# Altium project NANORACK_PHOTODIODE.PrjPcb
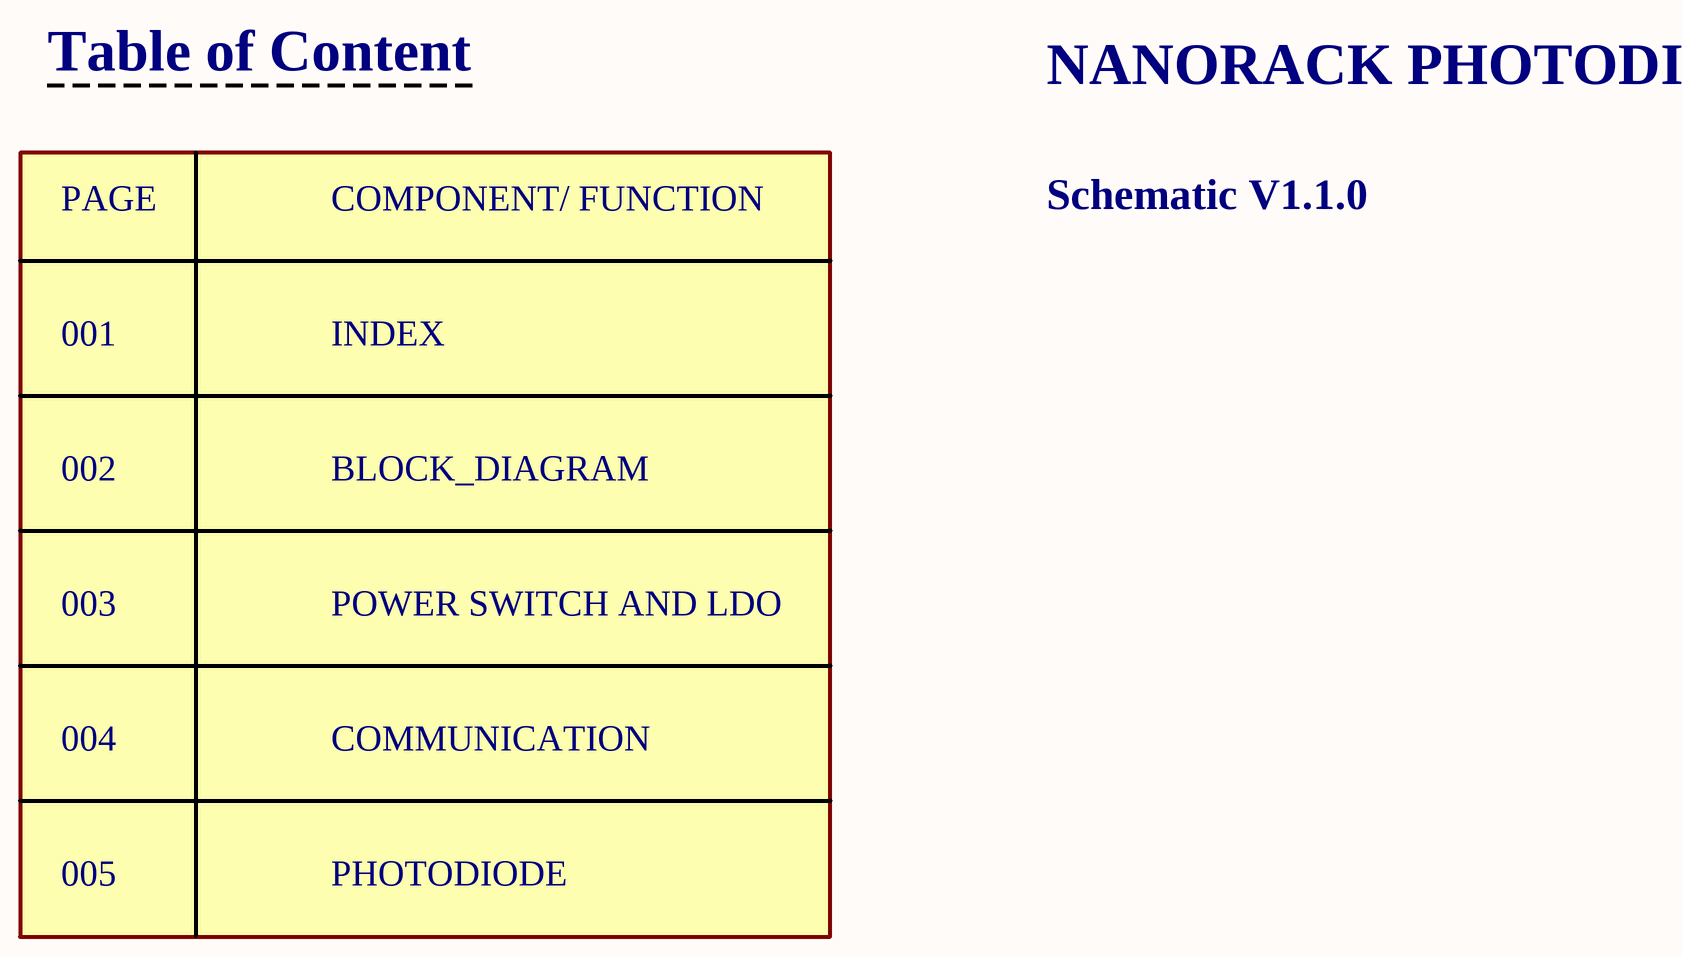
[diagram p0: INDEX.SchDoc]
5 sheets, 142 parts. Net scope: global (net labels, ports and power ports of the same name join across sheets).
Board file: PHOTODIODE_V1.2.0.PcbDoc
Sheets:
  INDEX.SchDoc
  BLOCK_DIAGRAM.SchDoc
  POWER SWITCH AND LDO.SchDoc
  COMMUNICATION.SchDoc
  PHOTODIODE.SchDoc

## Sheet INDEX.SchDoc
size 420 x 297 mm; SheetNumber: 1; SheetTotal: 5

### Notes on the sheet
- Table of Content
- NANORACK PHOTODIODE
- PAGE
- COMPONENT/ FUNCTION
- Schematic V1.1.0
- 001
- INDEX
- 002
- BLOCK_DIAGRAM
- 003
- POWER SWITCH AND LDO
- 004
- COMMUNICATION
- 005
- PHOTODIODE
- Project:
- BEE-PC1
- Sub-system:
- Design by:
- Hung Nguyen D.
- Bao Bui Q.
- Sheet title:
- Sheet
- A3
- of
- Checked by:
- Approved by:
- Vu Pham
- Revision:
- Document No:
- V1.1.0
- Size:
- Date:

## Sheet BLOCK_DIAGRAM.SchDoc
size 420 x 297 mm; SheetNumber: 2; SheetTotal: 5

### Notes on the sheet
- Project:
- BEE-PC1
- Sub-system:
- Design by:
- Hung Nguyen D.
- Bao Bui Q.
- Sheet title:
- Sheet
- A3
- of
- Checked by:
- Approved by:
- Vu Pham
- Revision:
- Document No:
- V1.1.0
- Size:
- Date:

## Sheet POWER SWITCH AND LDO.SchDoc
size 420 x 297 mm; SheetNumber: 3; SheetTotal: 5
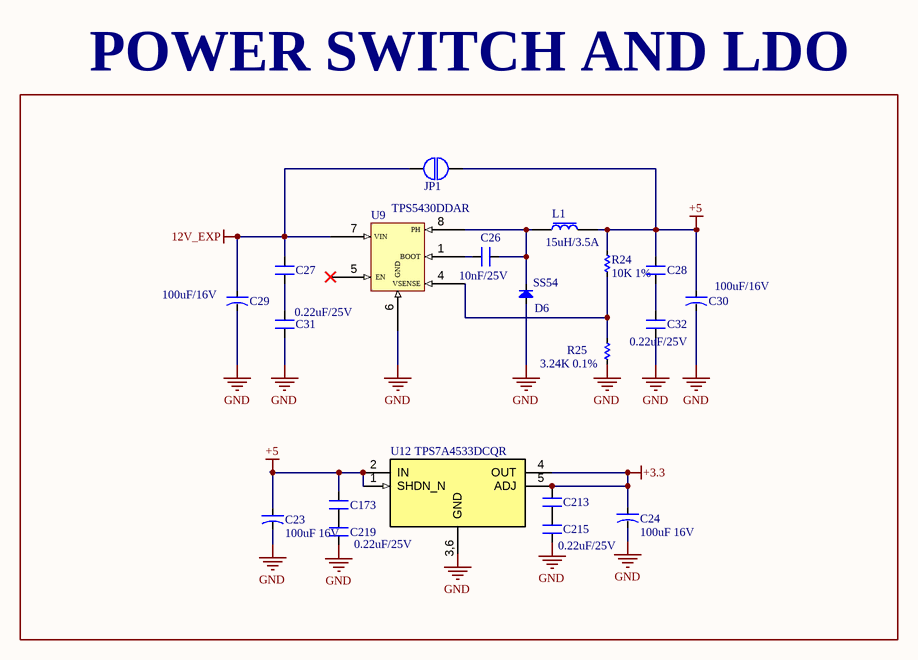
[diagram p1: POWER SWITCH AND LDO.SchDoc]

### Parts
C23  100uF 16V  [CAP TANT 2312]
C24  100uF 16V  [CAP TANT 2312]
C26  10nF/25V  [CN-SMD-0603]
C27  0.22uF/25V  [CN-SMD-0603]  (value not drawn)
C28  0.22uF/25V  [CN-SMD-0603]  (value not drawn)
C29  100uF/16V  [CAP TANT 2312]
C30  100uF/16V  [CAP TANT 2312]
C31  0.22uF/25V  [CN-SMD-0603]
C32  0.22uF/25V  [CN-SMD-0603]
C173  0.22uF/25V  [CN-SMD-0603]
C213  0.22uF/25V  [CN-SMD-0603]  (value not drawn)
C215  0.22uF/25V  [CN-SMD-0603]
C219  0.22uF/25V  [CN-SMD-0603]  (value not drawn)
D6  SS54  [DIO-SMD-A]
JP1  JUMP2  [Jump2]  (value not drawn)
L1  15uH/3.5A  [SRP7050TA]
R24  10K 1%  [RES-SMD-0603]
R25  3.24K 0.1%  [RES-SMD-0603]
U9  TPS5430DDAR  [HSOP8]
U12  TPS7A4533DCQR  [SOT223-6]

### Blocks framed on the sheet
POWER SWITCH AND LDO: C23 C24 C26-C32 C173 C213 C215 C219 D6 JP1 L1 R24 R25 U9 U12

### Nets
12V_EXP: C27.2 C29.1 JP1.1 U9.7(VIN)
+3.3: C24.1 C213.2 U12.4(OUT) U12.5(ADJ)
+5: C23.1 C28.2 C30.1 C173.2 JP1.2 L1.2 R24.2 U12.1(SHDN_N) U12.2(IN)
GND: C23.2 C24.2 C29.2 C30.2 C31.1 C32.1 C215.1 C219.1 D6.1(A) R25.1 U9.6(GND) U12.3,6(GND)
NetC26_1: C26.1 D6.2(K) L1.1 U9.8(PH)
NetC26_2: C26.2 U9.1(BOOT)
NetC27_1: C27.1 C31.2
NetC28_1: C28.1 C32.2
NetC173_1: C173.1 C219.2
NetC213_1: C213.1 C215.2
NetR24_1: R24.1 R25.2 U9.4(VSENSE)

Not connected (* = marked no-connect by the designer): U9 5(EN)*

### Notes on the sheet
- Project:
- BEE-PC1
- Sub-system:
- Design by:
- Hung Nguyen D.
- Bao Bui Q.
- Sheet title:
- Sheet
- A3
- of
- Checked by:
- Approved by:
- Vu Pham
- Revision:
- Document No:
- V1.1.0
- Size:
- Date:

### Library data of the parts
C23 C24 C29 C30 = CN-ALU-SMD: Polarized Capacitor (Axial); Published: 8-Jun-2000; LatestRevisionDate: 17-Jul-2002; LatestRevisionNote: Re-released for DXP Platform.; PackageReference: POLAR0.8; Publisher: Altium Limited
C26-C28 C31 C32 C173 C213 C215 C219 = CM: 0603; Value: 103
D6 = Diode SMD: DIODE SCHOTTKY 40V 5A SMA; Code - JEDEC: DO-214-AB; Value: 1N5007; Published: 8-Jun-2000; Revision: July-2002: Re-released for DXP Platform.; Publisher: Altium Limited
L1 = INDUCTOR: SRP7050TA-150M
R24 = Res-SMD: 0603; Manufacturer: Generic Components; Class: Passive; Published: 08/06/2000; Publisher: Altium Hobart Technology Centre
R25 = Res-SMD: ERA-3AEB3241V; Manufacturer: Generic Components; Class: Passive; Published: 08/06/2000; Publisher: Altium Hobart Technology Centre
U9 = TPS543X: 8SOP; pin to pad: 6>6+9
U12 = TPS7A4533DCQR: IC REG LINEAR 3.3V 1.5A SOT223-6

## Sheet COMMUNICATION.SchDoc
size 420 x 297 mm; SheetNumber: 4; SheetTotal: 5
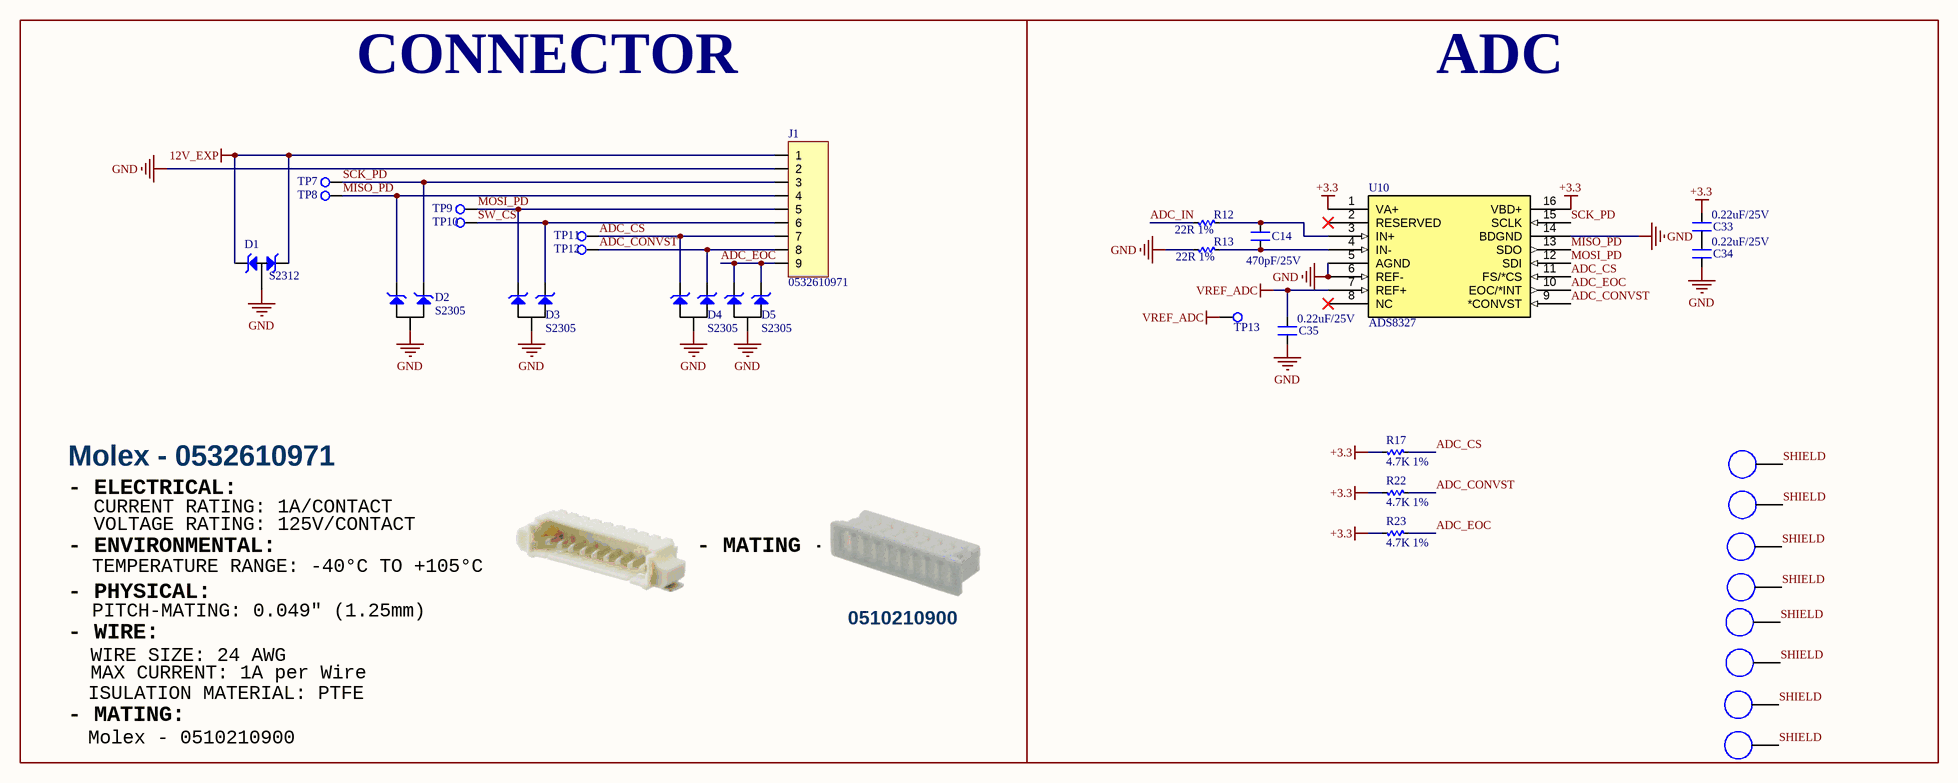
[diagram p2: COMMUNICATION.SchDoc]

### Parts
C14  470pF/25V  [CN-SMD-0603]
C33  0.22uF/25V  [CN-SMD-0603]
C34  0.22uF/25V  [CN-SMD-0603]
C35  0.22uF/25V  [CN-SMD-0603]
D1  S2312  [SOT23-123]
D2  S2305  [SOT23-123]
D3  S2305  [SOT23-123]
D4  S2305  [SOT23-123]
D5  S2305  [SOT23-123]
H1  HOLD  [M3 - 6mm]  (value not drawn)
H2  HOLD  [M3 - 6mm]  (value not drawn)
H3  HOLD  [M3 - 6mm]  (value not drawn)
H4  HOLD  [M3 - 6mm]  (value not drawn)
H5  HOLD  [M3 - 6mm]  (value not drawn)
H6  HOLD  [M3 - 6mm]  (value not drawn)
H7  HOLD  [M3 - 6mm]  (value not drawn)
H8  HOLD  [M3 - 6mm]  (value not drawn)
J1  0532610971  [0532610971]
R12  22R 1%  [RES-SMD-0603]
R13  22R 1%  [RES-SMD-0603]
R17  4.7K 1%  [RES-SMD-0603]
R22  4.7K 1%  [RES-SMD-0603]
R23  4.7K 1%  [RES-SMD-0603]
TP7  Test_Point  [TESTPOINT]  (value not drawn)
TP8  Test_Point  [TESTPOINT]  (value not drawn)
TP9  Test_Point  [TESTPOINT]  (value not drawn)
TP10  Test_Point  [TESTPOINT]  (value not drawn)
TP11  Test_Point  [TESTPOINT]  (value not drawn)
TP12  Test_Point  [TESTPOINT]  (value not drawn)
TP13  Test_Point  [TESTPOINT]  (value not drawn)
U10  ADS8327  [TSSOP16]

### Blocks framed on the sheet
CONNECTOR: D1-D5 J1 TP7-TP12
ADC: C14 C33-C35 H1-H8 R12 R13 R17 R22 R23 TP13 U10

### Nets
12V_EXP: D1.1 D1.3 J1.1
+3.3: C33.2 R17.2 R22.2 R23.2 U10.1(VA+) U10.16(VBD+)
GND: C34.1 C35.1 D1.2 D2.2 D3.2 D4.2 D5.2 J1.2 R13.2 U10.5(AGND) U10.6(REF-) U10.14(BDGND)
VREF_ADC: C35.2 TP13.1 U10.7(REF+)
ADC_CONVST: D4.3 J1.8 R22.1 TP12.1 U10.9(*CONVST)
ADC_CS: D4.1 J1.7 R17.1 TP11.1 U10.11(FS/*CS)
ADC_EOC: D5.1 D5.3 J1.9 R23.1 U10.10(EOC/*INT)
ADC_IN: R12.2
MISO_PD: D2.3 J1.4 TP8.1 U10.13(SDO)
MOSI_PD: D3.1 J1.5 TP9.1 U10.12(SDI)
SCK_PD: D2.1 J1.3 TP7.1 U10.15(SCLK)
SHIELD: H1.1 H2.1 H3.1 H4.1 H5.1 H6.1 H7.1 H8.1
SW_CS: D3.3 J1.6 TP10.1
NetC14_1: C14.1 R13.1 U10.4(IN-)
NetC14_2: C14.2 R12.1 U10.3(IN+)
NetC33_1: C33.1 C34.2

Not connected (* = marked no-connect by the designer): U10 2(RESERVED)* 8(NC)*

### Notes on the sheet
- Molex - 0532610971
- - ELECTRICAL:
- - ENVIRONMENTAL:
- CURRENT RATING: 1A/CONTACT
- VOLTAGE RATING: 125V/CONTACT
- - MATING -
- - PHYSICAL:
- TEMPERATURE RANGE: -40°C TO +105°C
- PITCH-MATING: 0.049" (1.25mm)
- 0510210900
- - WIRE:
- WIRE SIZE: 24 AWG
- MAX CURRENT: 1A per Wire
- - MATING:
- ISULATION MATERIAL: PTFE
- Molex - 0510210900
- Project:
- BEE-PC1
- Sub-system:
- Design by:
- Hung Nguyen D.
- Bao Bui Q.
- Sheet title:
- Sheet
- A3
- of
- Checked by:
- Approved by:
- Vu Pham
- Revision:
- Document No:
- V1.1.0
- Size:
- Date:

### Library data of the parts
C14 C33-C35 = CM: 0603; Value: 103
D1 = S2315: TVS DIODE 12VWM 19VC SOT23, P/N:  S2312
D2-D5 = S2303: TVS DIODE 5VWM 10.8VC SOT23, P/N: / S2305
H1-H8 = PAD_HOLD
J1 = JP9: WR-PHD 2.54 mm Angled Socket Header; Manufacturer: W¨¹rth Elektronik eiSos GmbH; partNo: 613009143121; ComponentLink1 Description: Manufacturer; ComponentLink2 Description: Datasheet; NoPins: 09; Created Date: 29 March 2013; ComponentLink1URL: http://www.we-online.com; ComponentLink2URL: http://katalog.we-online.de/em/datasheet/6130xx143121.pdf; Created by: Karrer Zheng
R12 R13 R17 R22 R23 = Res-SMD: as R24 on sheet POWER SWITCH AND LDO; Published: 08/06/2000; Publisher: Altium Hobart Technology Centre
U10 = ADS8327: IC ADC 16BIT SAR 16TSSOP; Supplier 1: Mouser; Supplier Part Number 1: 595-ADS8327IPW

## Sheet PHOTODIODE.SchDoc
size 420 x 297 mm; SheetNumber: 5; SheetTotal: 5
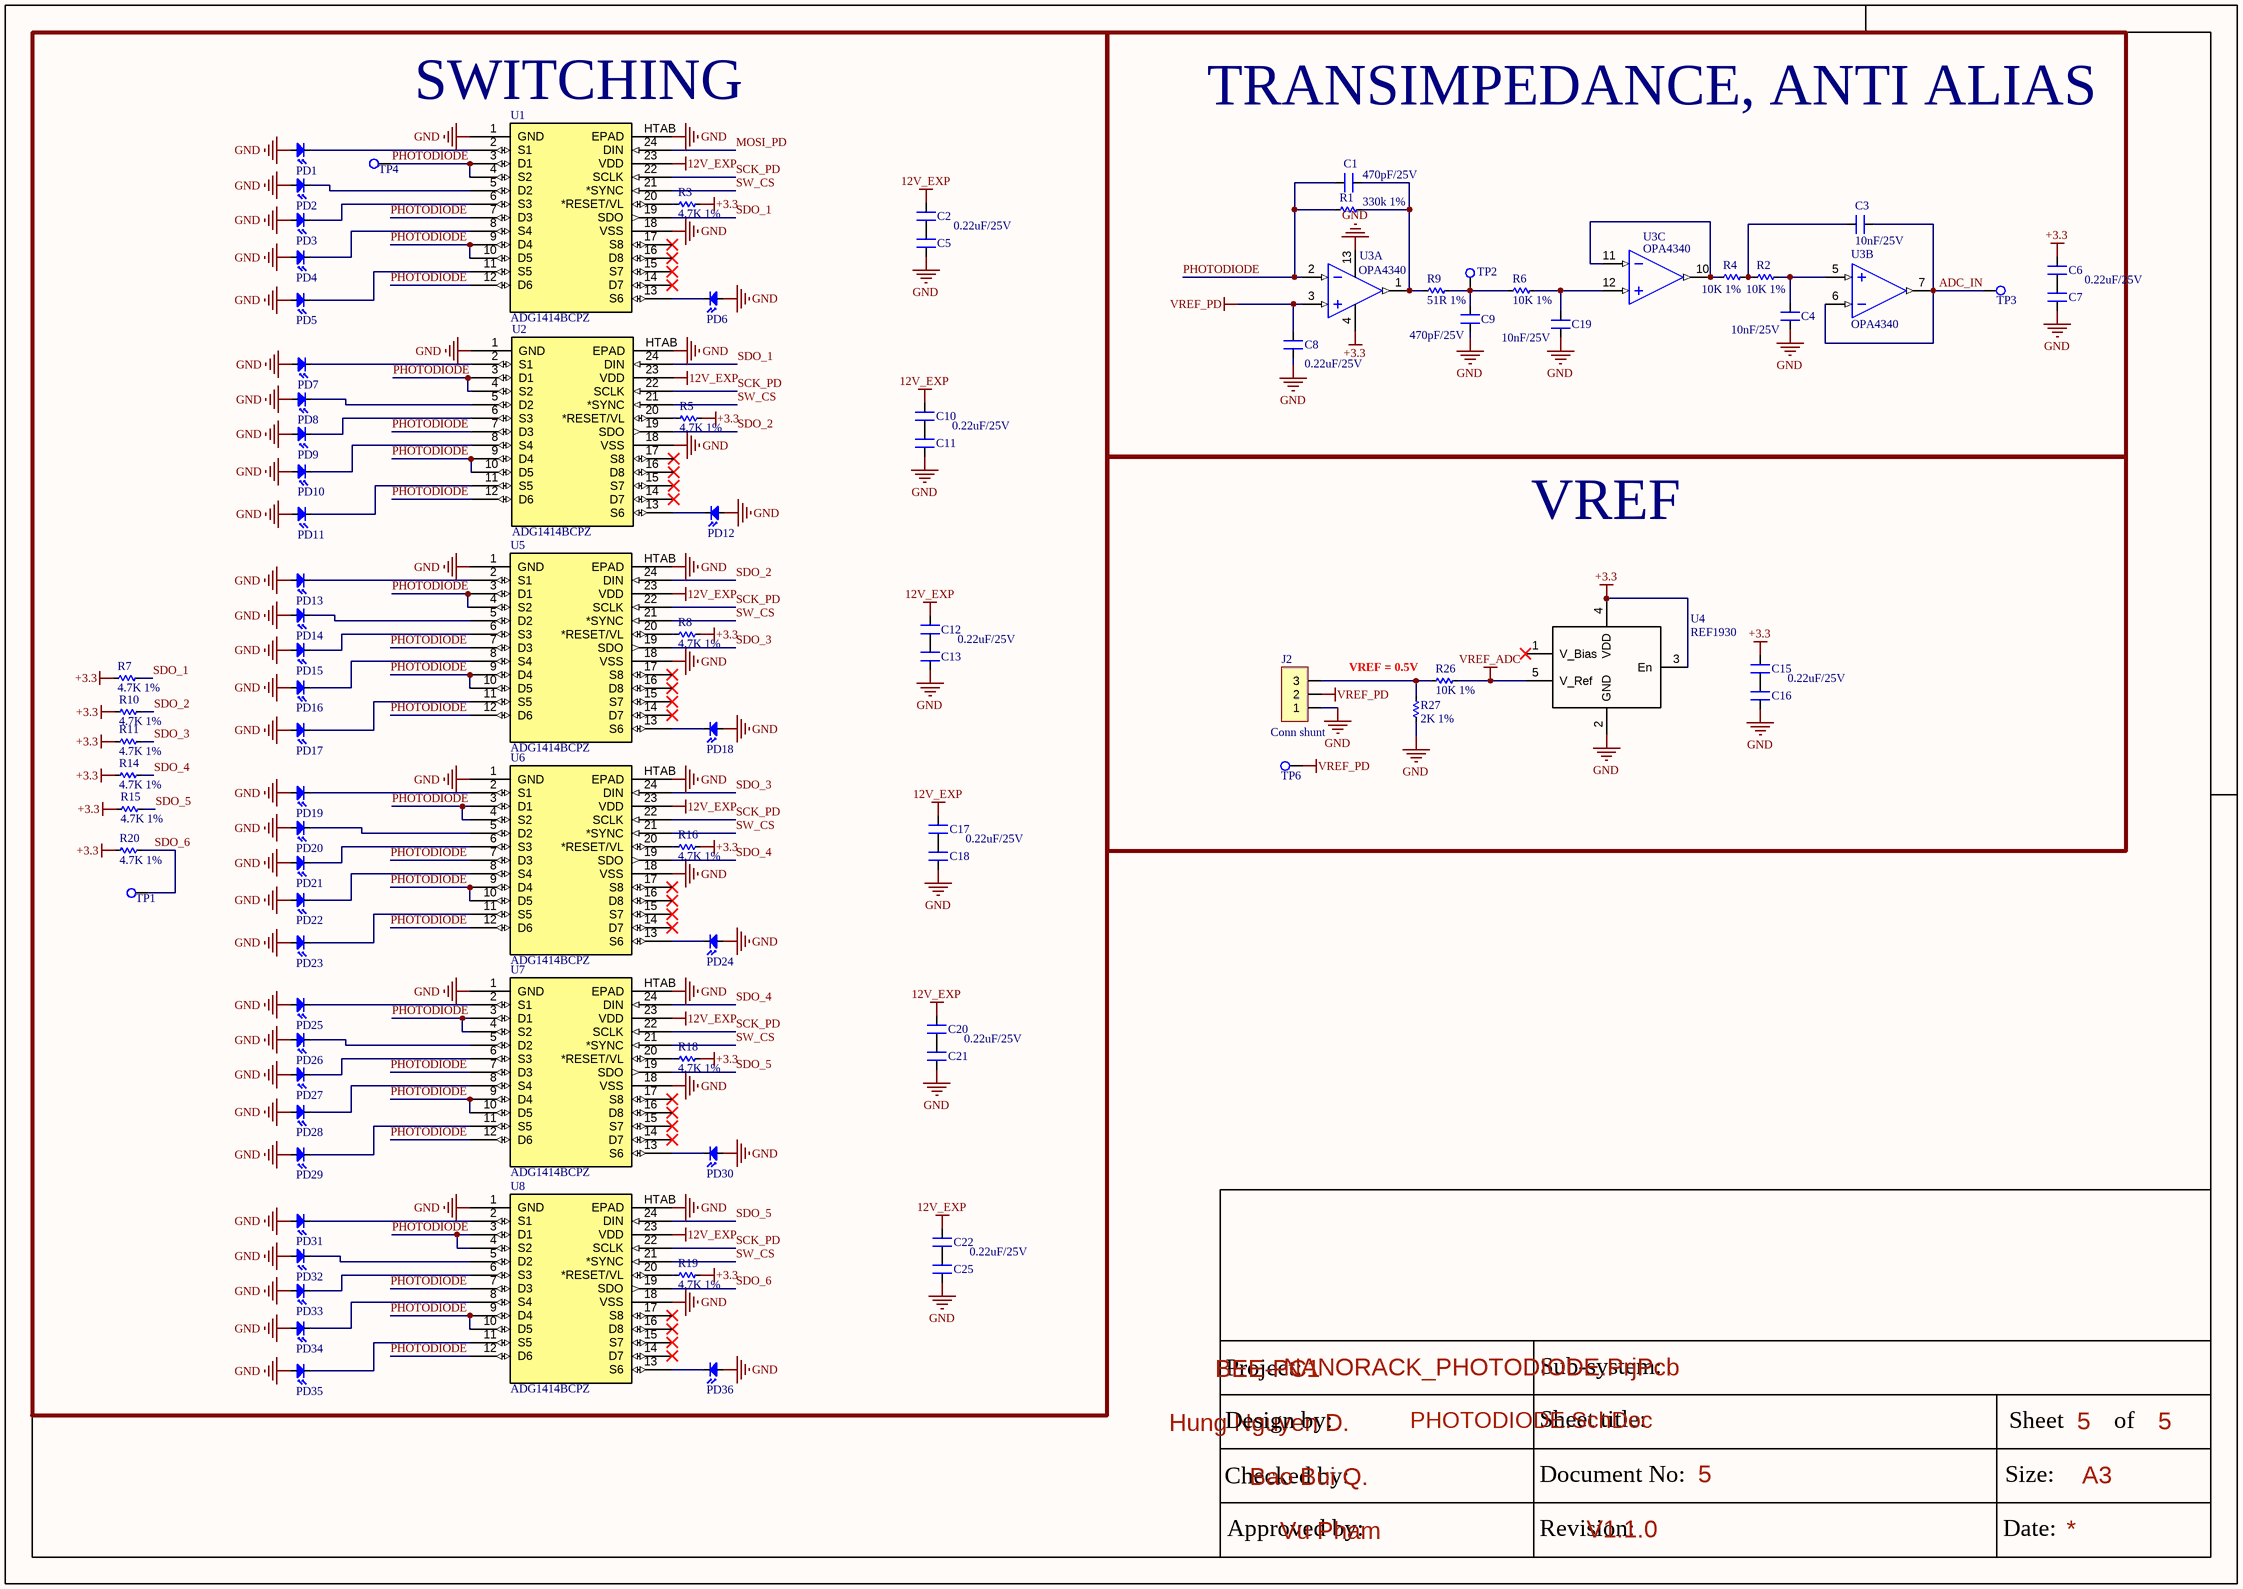
[diagram p3: PHOTODIODE.SchDoc]

### Parts
C1  470pF/25V  [CN-SMD-0603]
C2  0.22uF/25V  [CN-SMD-0603]
C3  10nF/25V  [CN-SMD-0603]
C4  10nF/25V  [CN-SMD-0603]
C5  0.22uF/25V  [CN-SMD-0603]  (value not drawn)
C6  0.22uF/25V  [CN-SMD-0603]
C7  0.22uF/25V  [CN-SMD-0603]  (value not drawn)
C8  0.22uF/25V  [CN-SMD-0603]
C9  470pF/25V  [CN-SMD-0603]
C10  0.22uF/25V  [CN-SMD-0603]
C11  0.22uF/25V  [CN-SMD-0603]  (value not drawn)
C12  0.22uF/25V  [CN-SMD-0603]
C13  0.22uF/25V  [CN-SMD-0603]  (value not drawn)
C15  0.22uF/25V  [CN-SMD-0603]
C16  0.22uF/25V  [CN-SMD-0603]  (value not drawn)
C17  0.22uF/25V  [CN-SMD-0603]
C18  0.22uF/25V  [CN-SMD-0603]  (value not drawn)
C19  10nF/25V  [CN-SMD-0603]
C20  0.22uF/25V  [CN-SMD-0603]
C21  0.22uF/25V  [CN-SMD-0603]  (value not drawn)
C22  0.22uF/25V  [CN-SMD-0603]
C25  0.22uF/25V  [CN-SMD-0603]  (value not drawn)
J2  Conn shunt  [M50-3930342]
PD1  Photodiode  [VEMD5080X01]  (value not drawn)
PD2  Photodiode  [VEMD5080X01]  (value not drawn)
PD3  Photodiode  [VEMD5080X01]  (value not drawn)
PD4  Photodiode  [VEMD5080X01]  (value not drawn)
PD5  Photodiode  [VEMD5080X01]  (value not drawn)
PD6  Photodiode  [VEMD5080X01]  (value not drawn)
PD7  Photodiode  [VEMD5080X01]  (value not drawn)
PD8  Photodiode  [VEMD5080X01]  (value not drawn)
PD9  Photodiode  [VEMD5080X01]  (value not drawn)
PD10  Photodiode  [VEMD5080X01]  (value not drawn)
PD11  Photodiode  [VEMD5080X01]  (value not drawn)
PD12  Photodiode  [VEMD5080X01]  (value not drawn)
PD13  Photodiode  [VEMD5080X01]  (value not drawn)
PD14  Photodiode  [VEMD5080X01]  (value not drawn)
PD15  Photodiode  [VEMD5080X01]  (value not drawn)
PD16  Photodiode  [VEMD5080X01]  (value not drawn)
PD17  Photodiode  [VEMD5080X01]  (value not drawn)
PD18  Photodiode  [VEMD5080X01]  (value not drawn)
PD19  Photodiode  [VEMD5080X01]  (value not drawn)
PD20  Photodiode  [VEMD5080X01]  (value not drawn)
PD21  Photodiode  [VEMD5080X01]  (value not drawn)
PD22  Photodiode  [VEMD5080X01]  (value not drawn)
PD23  Photodiode  [VEMD5080X01]  (value not drawn)
PD24  Photodiode  [VEMD5080X01]  (value not drawn)
PD25  Photodiode  [VEMD5080X01]  (value not drawn)
PD26  Photodiode  [VEMD5080X01]  (value not drawn)
PD27  Photodiode  [VEMD5080X01]  (value not drawn)
PD28  Photodiode  [VEMD5080X01]  (value not drawn)
PD29  Photodiode  [VEMD5080X01]  (value not drawn)
PD30  Photodiode  [VEMD5080X01]  (value not drawn)
PD31  Photodiode  [VEMD5080X01]  (value not drawn)
PD32  Photodiode  [VEMD5080X01]  (value not drawn)
PD33  Photodiode  [VEMD5080X01]  (value not drawn)
PD34  Photodiode  [VEMD5080X01]  (value not drawn)
PD35  Photodiode  [VEMD5080X01]  (value not drawn)
PD36  Photodiode  [VEMD5080X01]  (value not drawn)
R1  330k 1%  [RES-SMD-0603]
R2  10K 1%  [RES-SMD-0603]
R3  4.7K 1%  [RES-SMD-0603]
R4  10K 1%  [RES-SMD-0603]
R5  4.7K 1%  [RES-SMD-0603]
R6  10K 1%  [RES-SMD-0603]
R7  4.7K 1%  [RES-SMD-0603]
R8  4.7K 1%  [RES-SMD-0603]
R9  51R 1%  [RES-SMD-0603]
R10  4.7K 1%  [RES-SMD-0603]
R11  4.7K 1%  [RES-SMD-0603]
R14  4.7K 1%  [RES-SMD-0603]
R15  4.7K 1%  [RES-SMD-0603]
R16  4.7K 1%  [RES-SMD-0603]
R18  4.7K 1%  [RES-SMD-0603]
R19  4.7K 1%  [RES-SMD-0603]
R20  4.7K 1%  [RES-SMD-0603]
R26  10K 1%  [RES-SMD-0603]
R27  2K 1%  [RES-SMD-0603]
TP1  Test_Point  [TESTPOINT]  (value not drawn)
TP2  Test_Point  [TESTPOINT]  (value not drawn)
TP3  Test_Point  [TESTPOINT]  (value not drawn)
TP4  Test_Point  [TESTPOINT]  (value not drawn)
TP6  Test_Point  [TESTPOINT]  (value not drawn)
U1  ADG1414BCPZ  [ADG1414BCPZ]
U2  ADG1414BCPZ  [ADG1414BCPZ]
U3  OPA4340  [SSOP16]  (parts A,B,C of 4)
U4  REF1930  [SOT23-5]
U5  ADG1414BCPZ  [ADG1414BCPZ]
U6  ADG1414BCPZ  [ADG1414BCPZ]
U7  ADG1414BCPZ  [ADG1414BCPZ]
U8  ADG1414BCPZ  [ADG1414BCPZ]

### Blocks framed on the sheet
SWITCHING: C2 C5 C10-C13 C17 C18 C20-C22 C25 PD1-PD36 R3 R5 R7 R8 R10 R11 R14-R16 R18-R20 TP1 TP4 U1 U2 U5-U8
TRANSIMPEDANCE, ANTI ALIAS: C1 C3 C4 C6-C9 C19 R1 R2 R4 R6 R9 TP2 TP3 U3
VREF: C15 C16 J2 R26 R27 TP6 U4

### Nets
12V_EXP: C2.2 C10.2 C12.2 C17.2 C20.2 C22.2 U1.23(VDD) U2.23(VDD) U5.23(VDD) U6.23(VDD) U7.23(VDD) U8.23(VDD)
+3.3: C6.2 C15.2 R3.2 R5.2 R7.2 R8.2 R10.2 R11.2 R14.2 R15.2 R16.2 R18.2 R19.2 R20.2 U3.4(+V) U4.3(En) U4.4(VDD)
GND: C4.1 C5.1 C7.1 C8.1 C9.1 C11.1 C13.1 C16.1 C18.1 C19.1 C21.1 C25.1 J2.1 PD1.1(A) PD2.1(A) PD3.1(A) PD4.1(A) PD5.1(A) PD6.1(A) PD7.1(A) PD8.1(A) PD9.1(A) PD10.1(A) PD11.1(A) PD12.1(A) PD13.1(A) PD14.1(A) PD15.1(A) PD16.1(A) PD17.1(A) PD18.1(A) PD19.1(A) PD20.1(A) PD21.1(A) PD22.1(A) PD23.1(A) PD24.1(A) PD25.1(A) PD26.1(A) PD27.1(A) PD28.1(A) PD29.1(A) PD30.1(A) PD31.1(A) PD32.1(A) PD33.1(A) PD34.1(A) PD35.1(A) PD36.1(A) R27.1 U1.1(GND) U1.18(VSS) U1.HTAB(EPAD) U2.1(GND) U2.18(VSS) U2.HTAB(EPAD) U3.13(-V) U4.2(GND) U5.1(GND) U5.18(VSS) U5.HTAB(EPAD) U6.1(GND) U6.18(VSS) U6.HTAB(EPAD) U7.1(GND) U7.18(VSS) U7.HTAB(EPAD) U8.1(GND) U8.18(VSS) U8.HTAB(EPAD)
VREF_ADC: R26.1 U4.5(V_Ref)
VREF_PD: C8.2 J2.2 TP6.1 U3.3(IN+)
ADC_IN: C3.1 TP3.1 U3.6(IN-) U3.7(OUT)
MOSI_PD: U1.24(DIN)
PHOTODIODE: C1.1 R1.1 TP4.1 U1.3(D1) U1.4(S2) U1.7(D3) U1.9(D4) U1.10(D5) U1.12(D6) U2.3(D1) U2.4(S2) U2.7(D3) U2.9(D4) U2.10(D5) U2.12(D6) U3.2(IN-) U5.3(D1) U5.4(S2) U5.7(D3) U5.9(D4) U5.10(D5) U5.12(D6) U6.3(D1) U6.4(S2) U6.7(D3) U6.9(D4) U6.10(D5) U6.12(D6) U7.3(D1) U7.4(S2) U7.7(D3) U7.9(D4) U7.10(D5) U7.12(D6) U8.3(D1) U8.4(S2) U8.7(D3) U8.9(D4) U8.10(D5) U8.12(D6)
SCK_PD: U1.22(SCLK) U2.22(SCLK) U5.22(SCLK) U6.22(SCLK) U7.22(SCLK) U8.22(SCLK)
SDO_1: R7.1 U1.19(SDO) U2.24(DIN)
SDO_2: R10.1 U2.19(SDO) U5.24(DIN)
SDO_3: R11.1 U5.19(SDO) U6.24(DIN)
SDO_4: R14.1 U6.19(SDO) U7.24(DIN)
SDO_5: R15.1 U7.19(SDO) U8.24(DIN)
SDO_6: R20.1 TP1.1 U8.19(SDO)
SW_CS: U1.21(*SYNC) U2.21(*SYNC) U5.21(*SYNC) U6.21(*SYNC) U7.21(*SYNC) U8.21(*SYNC)
NetC1_2: C1.2 R1.2 R9.1 U3.1(OUT)
NetC2_1: C2.1 C5.2
NetC3_2: C3.2 R2.1 R4.2
NetC4_2: C4.2 R2.2 U3.5(IN+)
NetC6_1: C6.1 C7.2
NetC9_2: C9.2 R6.1 R9.2 TP2.1
NetC10_1: C10.1 C11.2
NetC12_1: C12.1 C13.2
NetC15_1: C15.1 C16.2
NetC17_1: C17.1 C18.2
NetC19_2: C19.2 R6.2 U3.12(IN+)
NetC20_1: C20.1 C21.2
NetC22_1: C22.1 C25.2
NetJ2_3: J2.3 R26.2 R27.2
NetPD1_2: PD1.2(K) U1.2(S1)
NetPD2_2: PD2.2(K) U1.5(D2)
NetPD3_2: PD3.2(K) U1.6(S3)
NetPD4_2: PD4.2(K) U1.8(S4)
NetPD5_2: PD5.2(K) U1.11(S5)
NetPD6_2: PD6.2(K) U1.13(S6)
NetPD7_2: PD7.2(K) U2.2(S1)
NetPD8_2: PD8.2(K) U2.5(D2)
NetPD9_2: PD9.2(K) U2.6(S3)
NetPD10_2: PD10.2(K) U2.8(S4)
NetPD11_2: PD11.2(K) U2.11(S5)
NetPD12_2: PD12.2(K) U2.13(S6)
NetPD13_2: PD13.2(K) U5.2(S1)
NetPD14_2: PD14.2(K) U5.5(D2)
NetPD15_2: PD15.2(K) U5.6(S3)
NetPD16_2: PD16.2(K) U5.8(S4)
NetPD17_2: PD17.2(K) U5.11(S5)
NetPD18_2: PD18.2(K) U5.13(S6)
NetPD19_2: PD19.2(K) U6.2(S1)
NetPD20_2: PD20.2(K) U6.5(D2)
NetPD21_2: PD21.2(K) U6.6(S3)
NetPD22_2: PD22.2(K) U6.8(S4)
NetPD23_2: PD23.2(K) U6.11(S5)
NetPD24_2: PD24.2(K) U6.13(S6)
NetPD25_2: PD25.2(K) U7.2(S1)
NetPD26_2: PD26.2(K) U7.5(D2)
NetPD27_2: PD27.2(K) U7.6(S3)
NetPD28_2: PD28.2(K) U7.8(S4)
NetPD29_2: PD29.2(K) U7.11(S5)
NetPD30_2: PD30.2(K) U7.13(S6)
NetPD31_2: PD31.2(K) U8.2(S1)
NetPD32_2: PD32.2(K) U8.5(D2)
NetPD33_2: PD33.2(K) U8.6(S3)
NetPD34_2: PD34.2(K) U8.8(S4)
NetPD35_2: PD35.2(K) U8.11(S5)
NetPD36_2: PD36.2(K) U8.13(S6)
NetR3_1: R3.1 U1.20(*RESET/VL)
NetR4_1: R4.1 U3.10(OUT) U3.11(IN-)
NetR5_1: R5.1 U2.20(*RESET/VL)
NetR8_1: R8.1 U5.20(*RESET/VL)
NetR16_1: R16.1 U6.20(*RESET/VL)
NetR18_1: R18.1 U7.20(*RESET/VL)
NetR19_1: R19.1 U8.20(*RESET/VL)

Not connected (* = marked no-connect by the designer): U1 14(D7)* 15(S7)* 16(D8)* 17(S8)*; U2 14(D7)* 15(S7)* 16(D8)* 17(S8)*; U4 1(V_Bias)*; U5 14(D7)* 15(S7)* 16(D8)* 17(S8)*; U6 14(D7)* 15(S7)* 16(D8)* 17(S8)*; U7 14(D7)* 15(S7)* 16(D8)* 17(S8)*; U8 14(D7)* 15(S7)* 16(D8)* 17(S8)*

### Notes on the sheet
- VREF = 0.5V
- Project:
- BEE-PC1
- Sub-system:
- Design by:
- Hung Nguyen D.
- Bao Bui Q.
- Sheet title:
- Sheet
- A3
- of
- Checked by:
- Approved by:
- Vu Pham
- Revision:
- Document No:
- V1.1.0
- Size:
- Date:

### Library data of the parts
C1-C13 C15-C22 C25 = CM: 0603; Value: 103
J2 = JP3: WR-PHD 2.54 mm Angled Socket Header; Manufacturer: W¨¹rth Elektronik eiSos GmbH; partNo: 613003143121; ComponentLink1 Description: Manufacturer; ComponentLink2 Description: Datasheet; NoPins: 03; Created Date: 29 March 2013; ComponentLink1URL: http://www.we-online.com; ComponentLink2URL: http://katalog.we-online.de/em/datasheet/6130xx143121.pdf; Created by: Karrer Zheng
R1-R11 R14-R16 R18-R20 R26 R27 = Res-SMD: as R24 on sheet POWER SWITCH AND LDO; Published: 08/06/2000; Publisher: Altium Hobart Technology Centre
U1 U2 U5-U8 = ADG1414: IC SW SPST-NOX8 11.5OHM 24LFCSP
U3 = OPA4340: IC CMOS 4 CIRCUIT 16SSOP; Supplier 1: Mouser; Supplier Part Number 1: 595-OPA4340UA/2K5
U4 = REF19xx: REF1941AIDDCT

## Nets that join several sheets
12V_EXP: POWER SWITCH AND LDO (C27.2 C29.1 JP1.1 U9.7), COMMUNICATION (D1.1 D1.3 J1.1), PHOTODIODE (12 pins)
+3.3: POWER SWITCH AND LDO (C24.1 C213.2 U12.4 U12.5), COMMUNICATION (6 pins), PHOTODIODE (17 pins)
GND: POWER SWITCH AND LDO (12 pins), COMMUNICATION (12 pins), PHOTODIODE (70 pins)
VREF_ADC: COMMUNICATION (C35.2 TP13.1 U10.7), PHOTODIODE (R26.1 U4.5)
ADC_IN: COMMUNICATION (R12.2), PHOTODIODE (C3.1 TP3.1 U3.6 U3.7)
MOSI_PD: COMMUNICATION (D3.1 J1.5 TP9.1 U10.12), PHOTODIODE (U1.24)
SCK_PD: COMMUNICATION (D2.1 J1.3 TP7.1 U10.15), PHOTODIODE (6 pins)
SW_CS: COMMUNICATION (D3.3 J1.6 TP10.1), PHOTODIODE (6 pins)